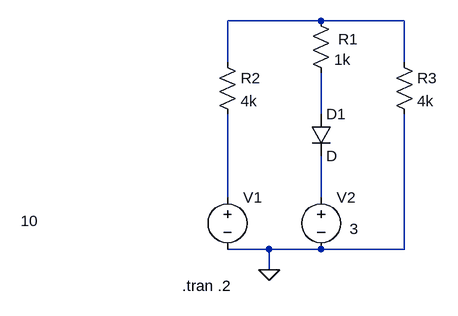
[diagram p0: schematic Draft1.asc]
Draft1.asc, the LTspice schematic file:
Version 4
SHEET 1 880 680
WIRE 96 -208 -48 -208
WIRE 224 -208 96 -208
WIRE -48 -144 -48 -208
WIRE 224 -144 224 -208
WIRE 96 -64 96 -128
WIRE -48 64 -48 -64
WIRE 96 64 96 0
WIRE 16 144 -48 144
WIRE 96 144 16 144
WIRE 224 144 224 -64
WIRE 224 144 96 144
WIRE 16 176 16 144
FLAG 16 176 0
SYMBOL voltage -48 48 R0
WINDOW 3 -318 52 Left 2
WINDOW 123 0 0 Left 0
WINDOW 39 0 0 Left 0
SYMATTR InstName V1
SYMATTR Value 10
SYMBOL voltage 96 48 R0
WINDOW 3 44 65 Left 2
SYMATTR InstName V2
SYMATTR Value 3
SYMBOL diode 80 -64 R0
SYMATTR InstName D1
SYMBOL res 80 -224 R0
WINDOW 0 42 44 Left 2
SYMATTR InstName R1
SYMATTR Value 1k
SYMBOL res -64 -160 R0
SYMATTR InstName R2
SYMATTR Value 4k
SYMBOL res 208 -160 R0
SYMATTR InstName R3
SYMATTR Value 4k
TEXT -118 200 Left 2 !.tran .2

The netlist it stands for:
* Draft1.asc
V1 N003 0 10
V2 N004 0 3
D1 N002 N004 D
R1 N001 N002 1k
R2 N001 N003 4k
R3 N001 0 4k
.model D D
.lib standard.dio
.tran .2
.backanno
.end